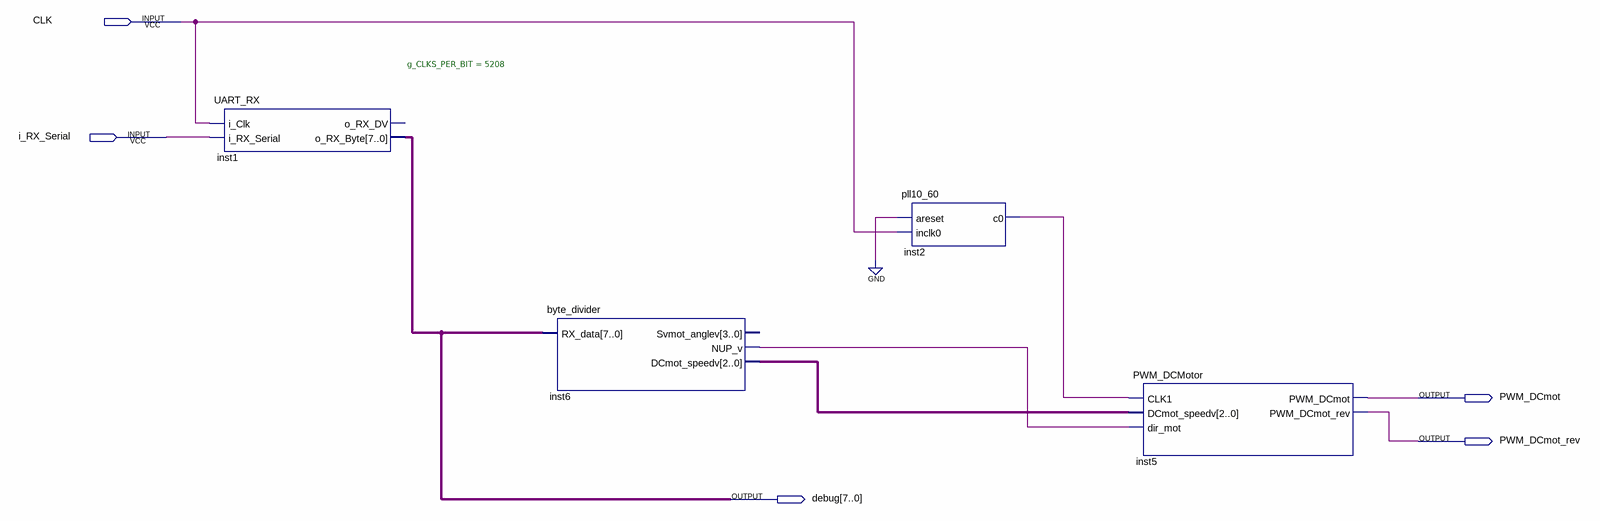
[diagram p0: schematic sheet]
// Quartus schematic Main.bdf as structural Verilog: 4 symbols, 5 pins
module Main (
  input  CLK,
  input  i_RX_Serial,
  output PWM_DCmot,
  output PWM_DCmot_rev,
  output [7:0] debug
);

  wire inst2_c0, inst6_nup_v;
  wire [2:0] inst6_dcmot_speedv;

  UART_RX #(.g_CLKS_PER_BIT(5208)) inst1 (.i_Clk(CLK), .i_RX_Serial(i_RX_Serial), .o_RX_Byte(debug));  // open: o_RX_DV
  byte_divider inst6 (.RX_data(debug), .NUP_v(inst6_nup_v), .DCmot_speedv(inst6_dcmot_speedv));  // open: Svmot_anglev
  pll10_60 inst2 (.areset(1'b0), .inclk0(CLK), .c0(inst2_c0));
  PWM_DCMotor inst5 (
    .CLK1(inst2_c0), .DCmot_speedv(inst6_dcmot_speedv), .dir_mot(inst6_nup_v), .PWM_DCmot(PWM_DCmot),
    .PWM_DCmot_rev(PWM_DCmot_rev));
endmodule
